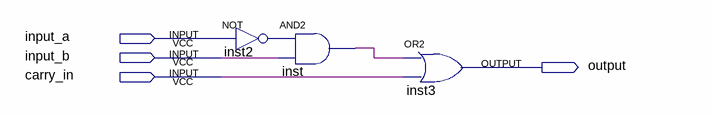
[diagram p0: schematic sheet]
// Quartus schematic menor_bit.bdf as structural Verilog: 3 symbols, 4 pins
module menor_bit (
  input  input_a,
  input  input_b,
  input  carry_in,
  output \output 
);

  wire inst2_out, inst_out;

  not inst2 (inst2_out, input_a);
  and inst (inst_out, inst2_out, input_b);
  or inst3 (\output , inst_out, carry_in);
endmodule
